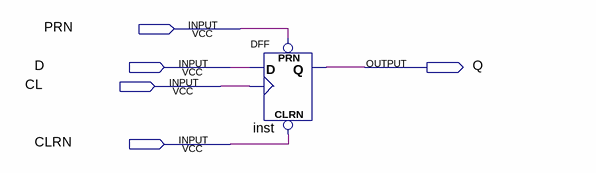
[diagram p0: schematic sheet]
// Quartus schematic rssim.bdf as structural Verilog: 1 symbols, 5 pins
module rssim (
  input  PRN,
  input  D,
  input  CL,
  input  CLRN,
  output Q
);

  DFF inst (.CLRN(CLRN), .CLK(CL), .D(D), .PRN(PRN), .Q(Q));
endmodule
